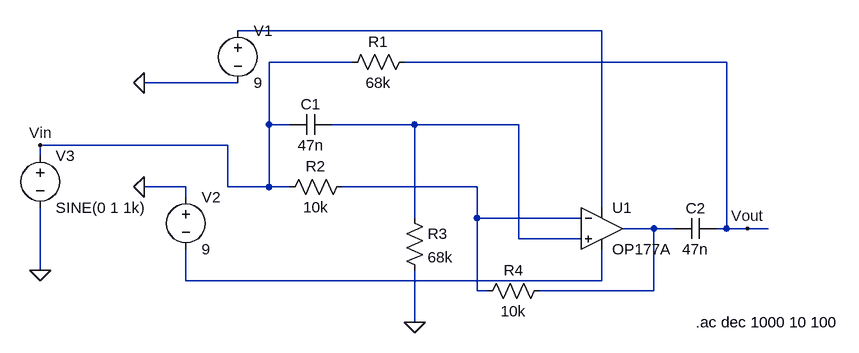
[diagram p0: schematic 50Hz-Notch.asc]
50Hz-Notch.asc, the LTspice schematic file:
Version 4
SHEET 1 880 680
WIRE 384 96 -176 96
WIRE 0 144 -128 144
WIRE 576 144 80 144
WIRE -176 176 -320 176
WIRE -128 240 -128 144
WIRE -96 240 -128 240
WIRE 96 240 -32 240
WIRE 256 240 96 240
WIRE -192 272 -480 272
WIRE -480 288 -480 272
WIRE -256 336 -320 336
WIRE -192 336 -192 272
WIRE -128 336 -128 240
WIRE -128 336 -192 336
WIRE -96 336 -128 336
WIRE 192 336 -16 336
WIRE -256 352 -256 336
WIRE 384 368 384 96
WIRE 96 384 96 240
WIRE 192 384 192 336
WIRE 352 384 192 384
WIRE 464 400 416 400
WIRE 496 400 464 400
WIRE 576 400 576 144
WIRE 576 400 560 400
WIRE 608 400 576 400
WIRE 640 400 608 400
WIRE 256 416 256 240
WIRE 352 416 256 416
WIRE -480 464 -480 368
WIRE -256 480 -256 432
WIRE 384 480 384 432
WIRE 384 480 -256 480
WIRE 192 496 192 384
WIRE 208 496 192 496
WIRE 464 496 464 400
WIRE 464 496 288 496
WIRE 96 544 96 464
FLAG 96 544 0
FLAG -320 336 0
FLAG -320 176 0
FLAG -480 464 0
FLAG -480 272 Vin
FLAG 608 400 Vout
SYMBOL OpAmps/OP177A 384 336 R0
SYMATTR InstName U1
SYMBOL voltage -176 80 R0
SYMATTR InstName V1
SYMATTR Value 9
SYMBOL voltage -256 336 R0
SYMATTR InstName V2
SYMATTR Value 9
SYMBOL voltage -480 272 R0
SYMATTR InstName V3
SYMATTR Value SINE(0 1 1k)
SYMATTR Value2 AC 1
SYMBOL Res 96 128 R90
WINDOW 0 0 56 VBottom 2
WINDOW 3 32 56 VTop 2
SYMATTR InstName R1
SYMATTR Value 68k
SYMBOL Res 0 320 R90
WINDOW 0 0 56 VBottom 2
WINDOW 3 32 56 VTop 2
SYMATTR InstName R2
SYMATTR Value 10k
SYMBOL Res 80 368 R0
SYMATTR InstName R3
SYMATTR Value 68k
SYMBOL Res 304 480 R90
WINDOW 0 0 56 VBottom 2
WINDOW 3 32 56 VTop 2
SYMATTR InstName R4
SYMATTR Value 10k
SYMBOL Cap -32 224 R90
WINDOW 0 0 32 VBottom 2
WINDOW 3 32 32 VTop 2
SYMATTR InstName C1
SYMATTR Value 47n
SYMBOL Cap 560 384 R90
WINDOW 0 0 32 VBottom 2
WINDOW 3 32 32 VTop 2
SYMATTR InstName C2
SYMATTR Value 47n
TEXT 528 544 Left 2 !.ac dec 1000 10 100

The netlist it stands for:
* 50Hz-Notch.asc
XU1 N002 N003 N001 N005 N004 OP177A  ; pins In+ In- V+ V- OUT
V1 N001 0 9
V2 0 N005 9
V3 Vin 0 SINE(0 1 1k) AC 1
R1 Vout Vin 68k
R2 N003 Vin 10k
R3 N002 0 68k
R4 N004 N003 10k
C1 N002 Vin 47n
C2 Vout N004 47n
.ac dec 1000 10 100
.backanno
.end